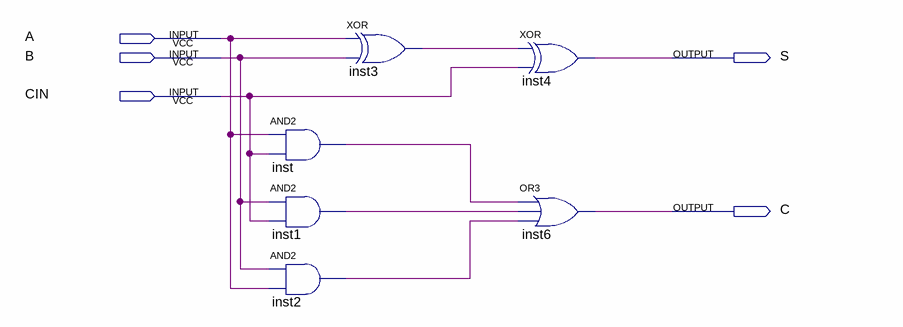
[diagram p0: schematic sheet]
// Quartus schematic Full_adder.bdf as structural Verilog: 6 symbols, 5 pins
module Full_adder (
  input  A,
  input  B,
  input  CIN,
  output S,
  output C
);

  wire inst1_out, inst2_out, inst3_out, inst_out;

  and inst (inst_out, A, CIN);
  and inst1 (inst1_out, B, CIN);
  and inst2 (inst2_out, B, A);
  xor inst3 (inst3_out, A, B);
  xor inst4 (S, inst3_out, CIN);
  or inst6 (C, inst_out, inst1_out, inst2_out);
endmodule
